# Altium schematic sheet wifi.SchDoc
size A3
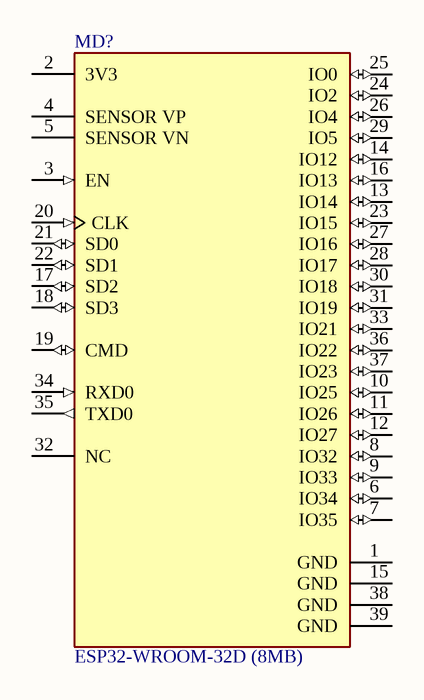
[diagram p0: wifi.SchDoc]

## Parts
MD?  ESP32-WROOM-32D (8MB)  [FP-ESP32-WROOM-32D_8MB-MFG]

## Nets

Not connected (* = marked no-connect by the designer): MD? 1(GND) 2(3V3) 3(EN) 4(SENSOR_VP) 5(SENSOR_VN) 6(IO34) 7(IO35) 8(IO32) 9(IO33) 10(IO25) 11(IO26) 12(IO27) 13(IO14) 14(IO12) 15(GND) 16(IO13) 17(SD2) 18(SD3) 19(CMD) 20(CLK) 21(SD0) 22(SD1) 23(IO15) 24(IO2) 25(IO0) 26(IO4) 27(IO16) 28(IO17) 29(IO5) 30(IO18) 31(IO19) 32(NC) 33(IO21) 34(RXD0) 35(TXD0) 36(IO22) 37(IO23) 38(GND) 39(GND)

## Library data of the parts
MD? = CMP-194065-000011-1: RX TXRX MOD WIFI TRACE ANT SMD; Interface: I2C; Memory Size: 536KB; Sensitivity: -98dBm; Frequency: 2.5GHz; Data Rate: 150Mbps; Max Operating Temperature: 85°C; Mount: Surface Mount; Case/Package: SMD/SMT; Packaging: Tape and Reel; Min Operating Temperature: -40°C